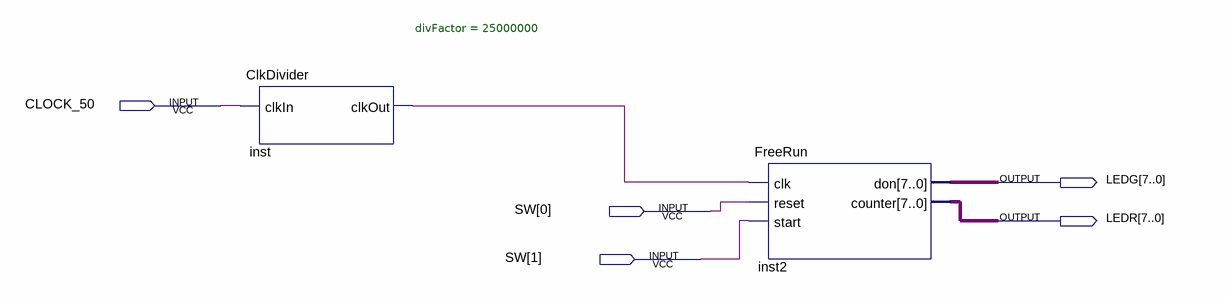
[diagram p0: schematic sheet]
// Quartus schematic Test.bdf as structural Verilog: 2 symbols, 5 pins
module Test (
  input  CLOCK_50,
  input  [1:0] SW,
  output [7:0] LEDG,
  output [7:0] LEDR
);

  wire inst_clkout;

  ClkDivider #(.divFactor(25000000)) inst (.clkIn(CLOCK_50), .clkOut(inst_clkout));
  FreeRun inst2 (.clk(inst_clkout), .reset(SW[0]), .start(SW[1]), .don(LEDG), .counter(LEDR));
endmodule
